# Altium schematic sheet POWER.SchDoc
size A4
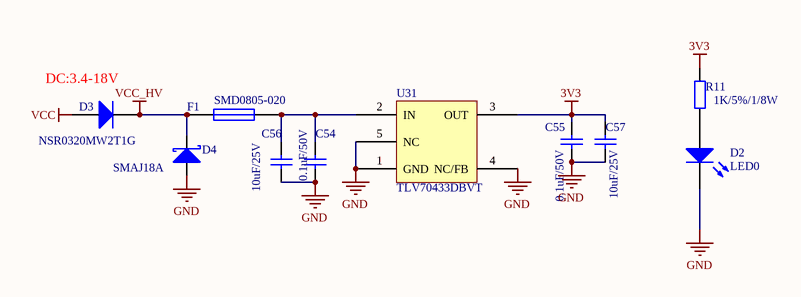
[diagram p0: POWER.SchDoc]

## Parts
C54  0.1uF/50V  [0402C]
C55  0.1uF/50V  [0402C]
C56  10uF/25V  [0402C]
C57  10uF/25V  [0402C]
D2  LED0  [0603LED]
D3  NSR0320MW2T1G  [sod323]
D4  SMAJ18A  [SMa]
F1  SMD0805-020  [0805R]
R11  1K/5%/1/8W  [0402R]
U31  TLV70433DBVT  [SOT23-5(DBV)]

## Nets
3V3: C55.1 C57.2 R11.1 U31.3(OUT)
GND: C54.2 C55.2 C56.1 C57.1 D2.2(K) D4.1(A) U31.1(GND) U31.4(NC/FB) U31.5(NC)
VCC: D3.A
VCC_HV: D3.K D4.2(K) F1.1
NetC54_1: C54.1 C56.2 F1.2 U31.2(IN)
NetD2_1: D2.1(A) R11.2

## Notes on the sheet
- (near D3) DC:3.4-18V

## Library data of the parts
C54 C55 = Cap: Capacitor; Value: 104; Published: 8-Jun-2000; LatestRevisionDate: 17-Jul-2002; LatestRevisionNote: Re-released for DXP Platform.; PackageReference: RAD-0.3; Publisher: Altium Limited
C56 C57 = Cap: Capacitor; Value: 106/50V; Published: 8-Jun-2000; LatestRevisionDate: 17-Jul-2002; LatestRevisionNote: Re-released for DXP Platform.; PackageReference: RAD-0.3; Publisher: Altium Limited
D2 = LED0: Typical INFRARED GaAs LED; Published: 8-Jun-2000; LatestRevisionDate: 08-Jul-2005; LatestRevisionNote: Mech Layer 1 removed.; PackageReference: LED-0; Publisher: Altium Limited
D3 = Diode: Default Diode; Published: 8-Jun-2000; LatestRevisionDate: 17-Jul-2002; LatestRevisionNote: Re-released for DXP Platform.; PackageVersion: Sep-1996; PackageReference: SMC; Publisher: Altium Limited; Code_JEDEC: DO-214-AB
D4 = DIODE S: Schottky Diode
F1 = Fuse 1: Fuse; Published: 8-Jun-2000; LatestRevisionDate: 17-Jul-2002; LatestRevisionNote: Re-released for DXP Platform.; PackageReference: PIN-W2/E2.8; Publisher: Altium Limited
R11 = Res2: Resistor; Value: 1K; Published: 8-Jun-2000; LatestRevisionDate: 17-Jul-2002; LatestRevisionNote: Re-released for DXP Platform.; PackageReference: AXIAL-0.4; Publisher: Altium Limited
U31 = TPS76318